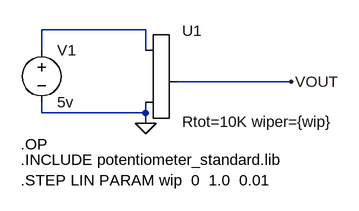
[diagram p0: schematic Divisor de tensión con potenciómetro.asc]
Divisor de tensión con potenciómetro.asc, the LTspice schematic file:
Version 4
SHEET 1 880 680
WIRE 192 144 32 144
WIRE 32 176 32 144
WIRE 192 176 192 144
WIRE 416 224 240 224
WIRE 32 272 32 256
WIRE 192 272 192 256
WIRE 192 272 32 272
WIRE 192 288 192 272
FLAG 192 288 0
FLAG 416 224 VOUT
SYMBOL potentiometer_standard 176 160 R0
SYMATTR InstName U1
SYMATTR Value Rtot=10K wiper={wip}
SYMBOL voltage 32 160 R0
SYMATTR InstName V1
SYMATTR Value 5v
TEXT 0 344 Left 2 !.INCLUDE potentiometer_standard.lib
TEXT 0 376 Left 2 !.STEP LIN PARAM wip  0  1.0  0.01
TEXT 0 320 Left 2 !.OP

The netlist it stands for:
* Divisor de tensión con potenciómetro.asc
XU1 N001 0 VOUT Rtot=10K wiper={wip}
V1 N001 0 5v
.INCLUDE potentiometer_standard.lib
.STEP LIN PARAM wip  0  1.0  0.01
.OP
.backanno
.end